# Altium schematic sheet (3) Controller A20_Ethernet.SchDoc
size 482 x 241 mm; SheetNumber: 3; SheetTotal: 6
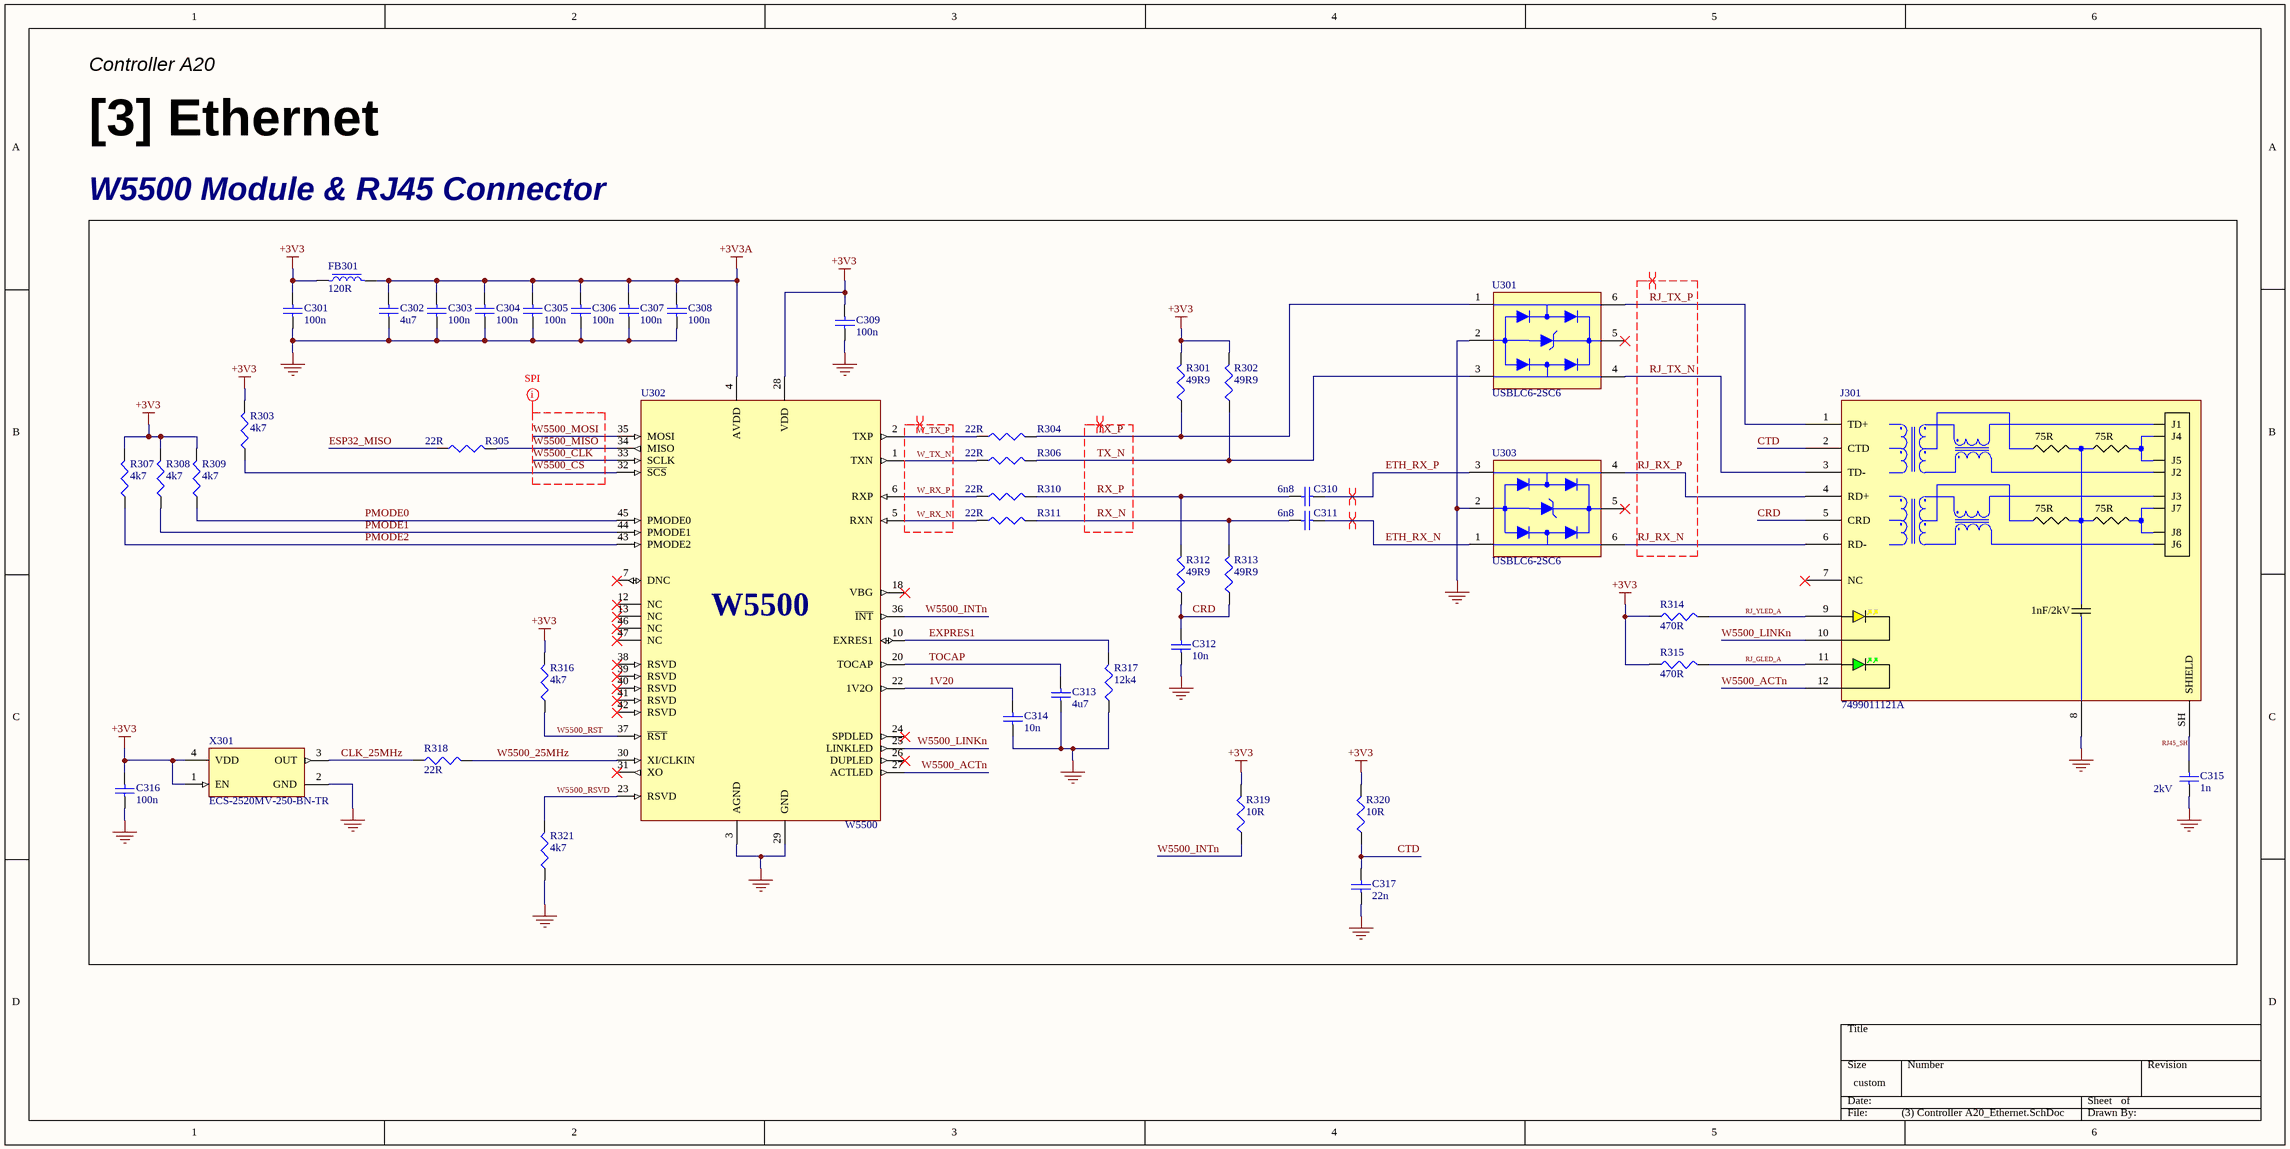
[diagram p0: (3) Controller A20_Ethernet.SchDoc]

## Parts
C301  100n  [C0603]
C302  4u7  [C0805]
C303  100n  [C0603]
C304  100n  [C0603]
C305  100n  [C0603]
C306  100n  [C0603]
C307  100n  [C0603]
C308  100n  [C0603]
C309  100n  [C0603]
C310  6n8  [C0402]
C311  6n8  [C0402]
C312  10n  [C0402]
C313  4u7  [C0805]
C314  10n  [C0402]
C315  1n  [C1206]
C316  100n  [C0603]
C317  22n  [C0402]
FB301  120R  [FB0402]
J301  7499011121A  [RJ45 TH Connector]
R301  49R9  [R0402]
R302  49R9  [R0402]
R303  4k7  [R0603]
R304  22R  [R0402]
R305  22R  [R0402]
R306  22R  [R0402]
R307  4k7  [R0603]
R308  4k7  [R0603]
R309  4k7  [R0603]
R310  22R  [R0402]
R311  22R  [R0402]
R312  49R9  [R0402]
R313  49R9  [R0402]
R314  470R  [R0603]
R315  470R  [R0603]
R316  4k7  [R0603]
R317  12k4  [R0603]
R318  22R  [R0402]
R319  10R  [R0402]
R320  10R  [R0402]
R321  4k7  [R0603]
U301  USBLC6-2SC6  [SOT23-6L]
U302  W5500  [LQFP-48(7x7)]
U303  USBLC6-2SC6  [SOT23-6L]
X301  ECS-2520MV-250-BN-TR  [SMD2520-4P]

## Nets
+3V3: C301.2 C309.2 C316.2 FB301.1 R301.2 R302.2 R303.2 R307.2 R308.2 R309.2 R314.1 R315.1 R316.2 R319.2 R320.2 U302.28(VDD) X301.1(EN) X301.4(VDD)
+3V3A: C302.2 C303.2 C304.2 C305.2 C306.2 C307.2 C308.2 FB301.2 U302.4(AVDD)
GND: C301.1 C302.1 C303.1 C304.1 C305.1 C306.1 C307.1 C308.1 C309.1 C312.1 C313.1 C314.1 C315.1 C316.1 C317.1 J301.8 R317.1 R321.1 U301.2 U302.3(AGND) U302.29(GND) U303.2 X301.2(GND)
1V20: C314.2 U302.22(1V2O)
CLK_25MHz: R318.1 X301.3(OUT)
CRD: C312.2 J301.5(CRD) R312.1 R313.1
CTD: C317.2 J301.2(CTD) R320.1
ESP32_MISO: R305.1
ETH_RX_N: C311.2 U303.1
ETH_RX_P: C310.2 U303.3
EXPRES1: R317.2 U302.10(EXRES1)
PMODE0: R309.1 U302.45(PMODE0)
PMODE1: R308.1 U302.44(PMODE1)
PMODE2: R307.1 U302.43(PMODE2)
RJ45_SH: C315.2 J301.SH(SHIELD)
RJ_GLED_A: J301.11(G_LED_A) R315.2
RJ_RX_N: J301.6(RD-) U303.6
RJ_RX_P: J301.4(RD+) U303.4
RJ_TX_N: J301.3(TD-) U301.4
RJ_TX_P: J301.1(TD+) U301.6
RJ_YLED_A: J301.9(Y_LED_A) R314.2
RX_N: C311.1 R311.2 R313.2
RX_P: C310.1 R310.2 R312.2
TOCAP: C313.2 U302.20(TOCAP)
TX_N: R302.1 R306.2 U301.3
TX_P: R301.1 R304.2 U301.1
W5500_25MHz: R318.2 U302.30(XI/CLKIN)
W5500_ACTn: J301.12(G_LED_K) U302.27(ACTLED)
W5500_CLK: U302.33(SCLK)
W5500_CS: R303.1 U302.32(~{SCS})
W5500_INTn: R319.1 U302.36(~{INT})
W5500_LINKn: J301.10(Y_LED_K) U302.25(LINKLED)
W5500_MISO: R305.2 U302.34(MISO)
W5500_MOSI: U302.35(MOSI)
W5500_RST: R316.1 U302.37(~{RST})
W5500_RSVD: R321.2 U302.23(RSVD)
W_RX_N: R311.1 U302.5(RXN)
W_RX_P: R310.1 U302.6(RXP)
W_TX_N: R306.1 U302.1(TXN)
W_TX_P: R304.1 U302.2(TXP)

Not connected (* = marked no-connect by the designer): J301 7(NC)*; U301 5*; U302 7(DNC)* 12(NC)* 13(NC)* 18(VBG)* 24(SPDLED)* 26(DUPLED)* 31(XO)* 38(RSVD)* 39(RSVD)* 40(RSVD)* 41(RSVD)* 42(RSVD)* 46(NC)* 47(NC)*; U303 5*

## Layout directives
differential pair; differential pair class ETH100; rule Matched Net Lengths [Delay Tolerance = 20ps]: ETH_RX_N, ETH_RX_P, RJ_RX_N, RJ_RX_P, RJ_TX_N, RJ_TX_P, RX_N, RX_P, TX_N, TX_P, W_RX_N, W_RX_P, W_TX_N, W_TX_P
rule Impedance Constraint [Min = 45.00    Max = 55.00    ]; net class SPI: W5500_CLK, W5500_CS, W5500_MISO, W5500_MOSI

## Notes on the sheet
- Controller A20
- [3] Ethernet
- W5500 Module & RJ45 Connector
- (near C315) 2kV
- (in symbol 7499011121A RJ45 Connector) J1; 75R; J4; J5; J2; J3; J7; J8; J6; 1nF/2kV

## Library data of the parts
C301 C303-C309 C316 = CAP 100nF 50V: 0.1 µF ±10% 50V Ceramic Capacitor X7R 0603 (1608 Metric); Manufacturer: KEMET; Mfr. Part #: C0603C104K5RACTU; Qty.: 10; Ext. Price: 0.11; Supplier: DigiKey; Supplier Part #: 399-C0603C104K5RACTUCT-ND; Package: 0603; Unit Price: 0.011; ComponentLink1Description: Datasheet; ComponentLink1URL: https://www.yageogroup.com/content/datasheet/asset/file/KEM_C1002_X7R_SMD; ComponentLink2Description: Distributor Link; ComponentLink2URL: https://www.digikey.com/en/products/detail/kemet/C0603C104K5RACTU/1465594
C302 C313 = CAP 4.7uF 50V: 4.7 µF ±20% 50V Ceramic Capacitor X7R 0805 (2012 Metric); Manufacturer: Murata Electronics; Mfr. Part #: GRM21BZ71H475ME15K; Qty.: 1; Ext. Price: 0.27; Supplier: DigiKey; Supplier Part #: 490-GRM21BZ71H475ME15KCT-ND; Package: 0805; Unit Price: 0.27; ComponentLink1Description: Datasheet; ComponentLink1URL: https://search.murata.co.jp/Ceramy/image/img/A01X/G101/ENG/GRM21BZ71H475ME15-01.pdf; ComponentLink2Description: Distributor Link; ComponentLink2URL: https://www.digikey.com/en/products/detail/murata-electronics/GRM21BZ71H475ME15K/13904866
C310 C311 = CAP 6.8nF 100V: 6800 pF ±10% 100V Ceramic Capacitor X7R 0402 (1005 Metric); Manufacturer: Samsung Electro-Mechanics; Mfr. Part #: CL05B682KC5VPNC; Qty.: 10; Ext. Price: 0.49; Supplier: DigiKey; Supplier Part #: 1276-CL05B682KC5VPNCCT-ND; Package: 0402; Unit Price: 0.049; ComponentLink1Description: Datasheet; ComponentLink1URL: https://mm.digikey.com/Volume0/opasdata/d220001/medias/docus/5458/CL05B682KC5VPNC_Spec.pdf; ComponentLink2Description: Distributor Link; ComponentLink2URL: https://www.digikey.com/en/products/detail/samsung-electro-mechanics/CL05B682KC5VPNC/20498579
C312 C314 = CAP 10nF 50V: 10000 pF ±10% 50V Ceramic Capacitor X7R 0402 (1005 Metric); Manufacturer: KEMET; Mfr. Part #: C0402C103K5REC7411; Qty.: 10; Ext. Price: 0.56; Supplier: DigiKey; Supplier Part #: 399-C0402C103K5REC7411CT-ND; Package: 0402; Unit Price: 0.056; ComponentLink1Description: Datasheet; ComponentLink1URL: https://www.yageogroup.com/content/datasheet/asset/file/KEM_C1090_X7R_ESD; ComponentLink2Description: Distributor Link; ComponentLink2URL: https://www.digikey.com/en/products/detail/kemet/C0402C103K5REC7411/8645041
C315 = CAP 1nF 2kV: 2kV 1nF X7R ±10% 1206 Multilayer Ceramic Capacitors MLCC - SMD/SMT ROHS; Manufacturer: Johanson Dielectrics; Mfr. Part #: 202R18W102KV4E; Qty.: 1; Ext. Price: 0.17; Supplier: DigiKey; Supplier Part #: 709-VPDD202W102K1GV001ECT-ND; Package: 1206; Unit Price: 0.17; ComponentLink1Description: Datasheet; ComponentLink2Description: Distributor Link; ComponentLink2URL: https://www.digikey.com/en/products/detail/johanson-dielectrics-inc/VPDD202W102K1GV001E/1556359?s=N4IgTCBcDa4AxgEoEYAcB1ZCDSA1ALAKIgC6AvkA
C317 = CAP 22nF 50V: 0.022 µF ±10% 50V Ceramic Capacitor X7R 0402 (1005 Metric); Manufacturer: YAGEO; Mfr. Part #: CC0402KRX7R9BB223; Qty.: 10; Ext. Price: 0.29; Supplier: DigiKey; Supplier Part #: 311-1722-1-ND; Package: 0402; Unit Price: 0.029; ComponentLink1Description: Datasheet; ComponentLink1URL: https://www.yageogroup.com/content/datasheet/asset/file/UPY-GPHC_X7R_6_3V-TO-250V; ComponentLink2Description: Distributor Link; ComponentLink2URL: https://www.digikey.com/en/products/detail/yageo/CC0402KRX7R9BB223/5195131
FB301 = BLM15PX121SN1D Ferrite Bead 120Ω: 120 Ohms @ 100 MHz 1 Power Line Ferrite Bead 0402 (1005 Metric) 2A 55mOhm; Manufacturer: Murata Electronics; Qty.: 1; Ext. Price: 0.1; Mfr. Part #: BLM15PX121SN1D; Supplier: DigiKey; Supplier Part #: 490-9656-1-ND; Package: 0402; Unit Price: 0.1; ComponentLink1Description: Datasheet; ComponentLink1URL: https://www.murata.com/en-us/products/productdata/8796740059166/ENFA0018.pdf; ComponentLink2Description: Distributor Link; ComponentLink2URL: https://www.digikey.com/en/products/detail/murata-electronics/BLM15PX121SN1D/4421095?s=N4IgTCBcDaIEIBkCyBGArABQBorCgygHIoAiIAugL5A
J301 = 7499011121A RJ45 Connector: 1 Port RJ45 with Magnetics Through Hole 10/100 Base-T, AutoMDIX; Manufacturer: Würth Elektronik; Qty.: 1; Ext. Price: 6.55; Mfr. Part #: 7499011121A; Supplier: DigiKey; Supplier Part #: 732-4509-5-ND; Package: Through Hole; Unit Price: 6.55; ComponentLink1Description: Datasheet; ComponentLink1URL: https://www.we-online.com/components/products/datasheet/7499011121A.pdf; ComponentLink2Description: Distributor Link; ComponentLink2URL: https://www.digikey.com/en/products/detail/w%C3%BCrth-elektronik/7499011121A/4031599
R301 R302 R312 R313 = RES 49.9R: 49.9 Ohms ±1% 0.063W, 1/16W Chip Resistor 0402 (1005 Metric) Moisture Resistant Thick Film; Manufacturer: YAGEO; Mfr. Part #: RC0402FR-0749R9L; Qty.: 10; Ext. Price: 0.2; Supplier: DigiKey; Supplier Part #: 311-49.9LRCT-ND; Package: 0402; Unit Price: 0.02; ComponentLink1Description: Datasheet; ComponentLink1URL: https://www.yageogroup.com/content/datasheet/asset/file/PYU-RC_GROUP_51_ROHS_L; ComponentLink2Description: Distributor Link; ComponentLink2URL: https://www.digikey.com/en/products/detail/yageo/RC0402FR-0749R9L/726621
R303 R307-R309 R316 R321 = RES 4.7k: 4.7 kOhms ±1% 0.1W, 1/10W Chip Resistor 0603 (1608 Metric) Moisture Resistant Thick Film; Manufacturer: YAGEO; Mfr. Part #: RC0603FR-074K7L; Qty.: 10; Ext. Price: 0.09; Supplier: DigiKey; Supplier Part #: 311-4.70KHRCT-ND; Package: 0603; Unit Price: 0.009; ComponentLink1Description: Datasheet; ComponentLink1URL: https://www.yageogroup.com/content/datasheet/asset/file/PYU-RC_GROUP_51_ROHS_L; ComponentLink2Description: Distributor Link; ComponentLink2URL: https://www.digikey.com/en/products/detail/yageo/RC0603FR-074K7L/727212
R304-R306 R310 R311 R318 = RES 22R: 22 Ohms ±1% 0.063W, 1/16W Chip Resistor 0402 (1005 Metric) Moisture Resistant Thick Film; Manufacturer: YAGEO; Mfr. Part #: RC0402FR-0722RL; Qty.: 10; Ext. Price: 0.07; Supplier: DigiKey; Supplier Part #: 311-22.0LRCT-ND; Package: 0402; Unit Price: 0.007; ComponentLink1Description: Datasheet; ComponentLink1URL: https://www.yageogroup.com/content/datasheet/asset/file/PYU-RC_GROUP_51_ROHS_L; ComponentLink2Description: Distributor Link; ComponentLink2URL: https://www.digikey.com/en/products/detail/yageo/RC0402FR-0722RL/726562
R314 R315 = RES 470R: 470 Ohms ±1% 0.1W, 1/10W Chip Resistor 0603 (1608 Metric) Thin Film; Manufacturer: YAGEO; Mfr. Part #: RT0603FRE07470RL; Qty.: 10; Ext. Price: 0.1; Supplier: DigiKey; Supplier Part #: YAG5742CT-ND; Package: 0603; Unit Price: 0.01; ComponentLink1Description: Datasheet; ComponentLink1URL: https://www.yageogroup.com/content/datasheet/asset/file/PYU-RT_1-TO-0-01_ROHS_L; ComponentLink2Description: Distributor Link; ComponentLink2URL: https://www.digikey.com/en/products/detail/yageo/RT0603FRE07470RL/1075383
R317 = RES 12.4k: 12.4 kOhms ±1% 0.1W, 1/10W Chip Resistor 0603 (1608 Metric) Moisture Resistant Thick Film; Manufacturer: YAGEO; Mfr. Part #: RC0603FR-0712K4L; Qty.: 10; Ext. Price: 0.07; Supplier: DigiKey; Supplier Part #: 311-12.4KHRCT-ND; Package: 0603; Unit Price: 0.007; ComponentLink1Description: Datasheet; ComponentLink1URL: https://www.yageogroup.com/content/datasheet/asset/file/PYU-RT_1-TO-0-01_ROHS_L; ComponentLink2Description: Distributor Link; ComponentLink2URL: https://www.digikey.com/en/products/detail/yageo/RC0603FR-0712K4L/726917
R319 R320 = RES 10R: 10 Ohms ±1% 0.063W, 1/16W Chip Resistor 0402 (1005 Metric) Automotive AEC-Q200, Moisture Resistant Thick Film; Manufacturer: YAGEO; Mfr. Part #: AC0402FR-0710RL; Qty.: 10; Ext. Price: 0.1; Supplier: DigiKey; Supplier Part #: YAG3438CT-ND; Package: 0402; Unit Price: 0.01; ComponentLink1Description: Datasheet; ComponentLink1URL: https://www.yageogroup.com/content/datasheet/asset/file/PYU-AC_51_ROHS_L; ComponentLink2Description: Distributor Link; ComponentLink2URL: https://www.digikey.com/en/products/detail/yageo/AC0402FR-0710RL/5895033
U301 U303 = USBLC6-2SC6 ESD Array 5.25VRWM: 17V Clamp 5A (8/20µs) Ipp Tvs Diode Surface Mount SOT-23-6; Manufacturer: STMicroelectronics; Qty.: 1; Ext. Price: 0.36; Mfr. Part #: USBLC6-2SC6; Supplier: DigiKey; Supplier Part #: 497-5235-1-ND; Package: SOT-23-6L; Unit Price: 0.36; ComponentLink1Description: Datasheet; ComponentLink1URL: https://www.st.com/content/ccc/resource/technical/document/datasheet/06/1d/48/9c/6c/20/4a/b2/CD00050750.pdf/files/CD00050750.pdf/jcr:content/translations/en.CD00050750.pdf; ComponentLink2Description: Distributor Link; ComponentLink2URL: https://www.digikey.com/en/products/detail/stmicroelectronics/USBLC6-2SC6/1040559
U302 = W5500 SPI to Ethernet: Ethernet Controller 10/100 Base-T/TX PHY SPI Interface 48-LQFP (7x7); Manufacturer: WIZnet; Qty.: 1; Ext. Price: 3.67; Mfr. Part #: W5500; Supplier: DigiKey; Supplier Part #: 1278-W5500CT-ND; Package: LQFP-48(7x7); Unit Price: 3.67; ComponentLink1Description: Datasheet; ComponentLink1URL: https://docs.wiznet.io/img/products/w5500/W5500_ds_v110e.pdf; ComponentLink2Description: Distributor Link; ComponentLink2URL: https://www.digikey.com/en/products/detail/wiznet/W5500/4425702
X301 = 25MHz HCMOS Oscillator: 25 MHz XO (Standard) HCMOS Oscillator 1.6V ~ 3.6V Enable/Disable 4-SMD, No Lead; Manufacturer: ECS Inc.; Qty.: 1; Ext. Price: 1.16; Mfr. Part #: ECS-2520MV-250-BN-TR; Supplier: DigiKey; Supplier Part #: XC2751CT-ND; Package: 4-SMD (2.5x2); Unit Price: 1.16; ComponentLink1Description: Datasheet; ComponentLink1URL: https://ecsxtal.com/store/pdf/ECS-2520MV.pdf; ComponentLink2Description: Distributor Link; ComponentLink2URL: https://www.digikey.com/en/products/detail/ecs-inc/ECS-2520MV-250-BN-TR/8593607?s=N4IgTCBcDaIKIGEDKBaMBWMAGAsgNTXSxQCEA5FAFQCUQBdAXyA